# EAGLE design Microphone (EAGLE 7.6.0)
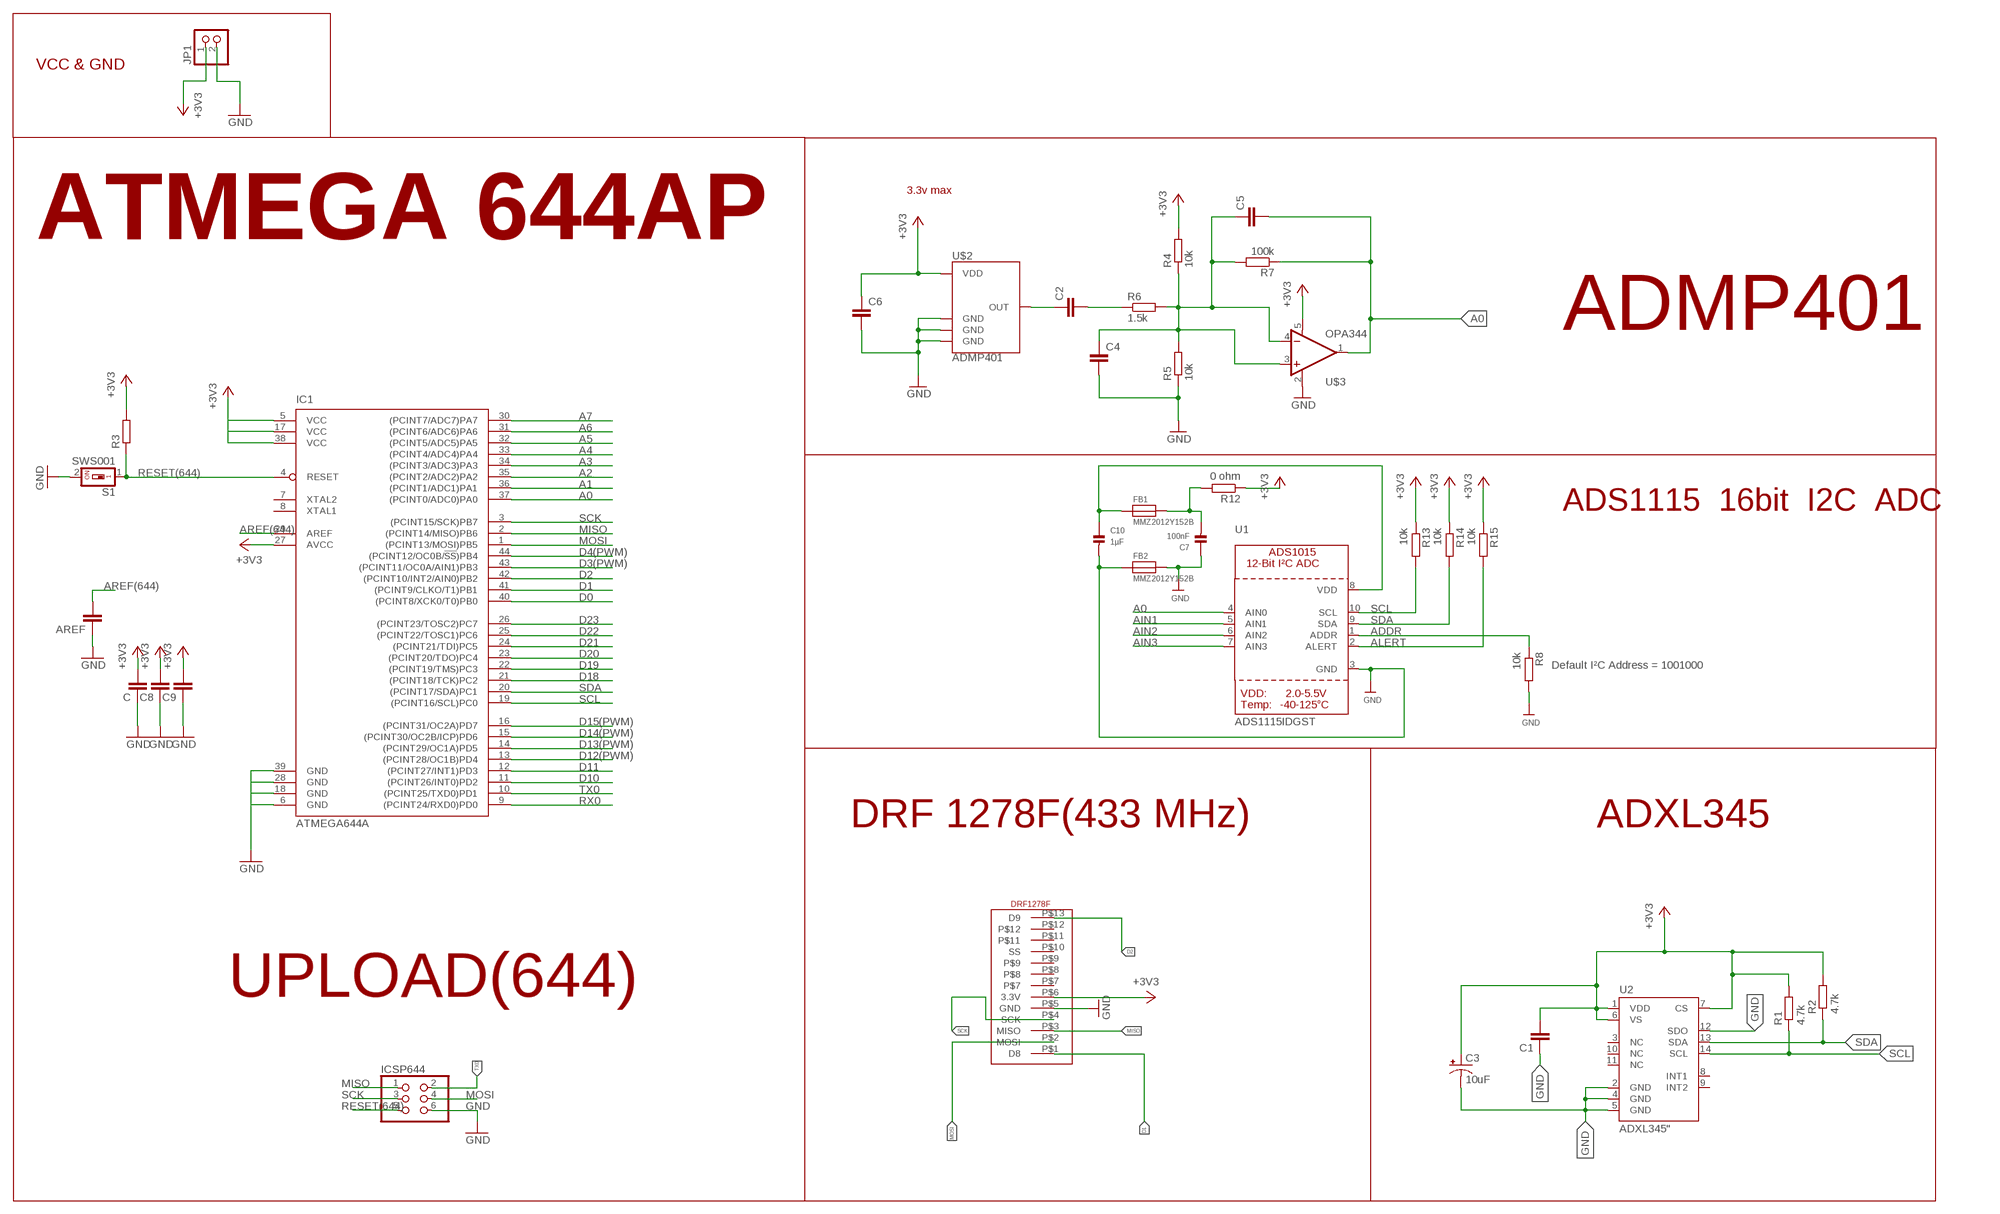
[diagram p0: schematic, sheet 1]

## Parts
AREF  100nF  C-EUC0805  [C0805]
C  22 uF  C-EUC0805  [C0805]
C1  0.1uF  C-EUC0805  [C0805]
C2  4.7uF  C-EUC0805  [C0805]
C3  10uF  CAP_POL1206  [EIA3216]
C4  1uF  C-EUC0805  [C0805]
C5  100pF  C-EUC0805  [C0805]
C6  0.1uF  C-EUC0805  [C0805]
C7  100nF  CAP_CERAMIC0805  [0805]
C8  100nF  C-EUC0805  [C0805]
C9  100nF  C-EUC0805  [C0805]
C10  1µF  CAP_CERAMIC0805  [0805]
FB1  MMZ2012Y152B  FERRITE0805  [0805]
FB2  MMZ2012Y152B  FERRITE0805  [0805]
IC1  ATMEGA644A  [TQFP44]
ICSP644  PINHD-2X3  [2X03]
JP1  PINHD-1X2  [1X02]
R1  4.7k  R-EU_R0805  [R0805]
R2  4.7k  R-EU_R0805  [R0805]
R3  R-EU_R0805  [R0805]
R4  10k  R-EU_R0805  [R0805]
R5  10k  R-EU_R0805  [R0805]
R6  1.5k  R-EU_R0805  [R0805]
R7  100k  R-EU_R0805  [R0805]
R8  10k  R-EU_R0805  [R0805]
R12  0 ohm  R-EU_R0805  [R0805]
R13  10k  R-EU_R0805  [R0805]
R14  10k  R-EU_R0805  [R0805]
R15  10k  R-EU_R0805  [R0805]
S1  SWS001  [SMS-001]
U1  ADS1115IDGST  ADC_ADS1015  [MSOP10]
U2  ADXL345"  [ADXL3451:1]
U$1  DRF1278F  [DIP13]
U$2  ADMP401  [ADMP401]
U$3  OPA344  [SOT23-5]

## Nets
+3V3: C1.2 C3.A(+) C6.1 C8.2 C9.2 C.2 IC1.5(VCC) IC1.17(VCC) IC1.27(AVCC) IC1.38(VCC) JP1.1 R1.2 R2.2 R3.2 R4.2 R12.1 R13.1 R14.1 R15.1 U2.1(VDD) U2.6(VS) U2.7(CS) U$1.P$6(3.3V) U$2.5(VDD) U$3.5(V+)
A0: C5.2 IC1.37((PCINT0/ADC0)PA0) R7.1 U1.4(AIN0) U$3.1(OUT)
A1: IC1.36((PCINT1/ADC1)PA1)
A2: IC1.35((PCINT2/ADC2)PA2)
A3: IC1.34((PCINT3/ADC3)PA3)
A4: IC1.33((PCINT4/ADC4)PA4)
A5: IC1.32((PCINT5/ADC5)PA5)
A6: IC1.31((PCINT6/ADC6)PA6)
A7: IC1.30((PCINT7/ADC7)PA7)
ADDR: R8.1 U1.1(ADDR)
AIN1: U1.5(AIN1)
AIN2: U1.6(AIN2)
AIN3: U1.7(AIN3)
ALERT: R15.2 U1.2(ALERT)
AREF(644): AREF.2 IC1.29(AREF)
D0: IC1.40((PCINT8/XCK0/T0)PB0)
D1: IC1.41((PCINT9/CLKO/T1)PB1) U$1.P$1(D8)
D2: IC1.42((PCINT10/INT2/AIN0)PB2) U$1.P$13(D9)
D3(PWM): IC1.43((PCINT11/OC0A/AIN1)PB3)
D4(PWM): IC1.44((PCINT12/OC0B/!SS!)PB4)
D10: IC1.11((PCINT26/INT0)PD2)
D11: IC1.12((PCINT27/INT1)PD3)
D12(PWM): IC1.13((PCINT28/OC1B)PD4)
D13(PWM): IC1.14((PCINT29/OC1A)PD5)
D14(PWM): IC1.15((PCINT30/OC2B/ICP)PD6)
D15(PWM): IC1.16((PCINT31/OC2A)PD7)
D18: IC1.21((PCINT18/TCK)PC2)
D19: IC1.22((PCINT19/TMS)PC3)
D20: IC1.23((PCINT20/TDO)PC4)
D21: IC1.24((PCINT21/TDI)PC5)
D22: IC1.25((PCINT22/TOSC1)PC6)
D23: IC1.26((PCINT23/TOSC2)PC7)
GND: AREF.1 C1.1 C3.C(-) C4.2 C6.2 C7.1 C8.1 C9.1 C10.2 C.1 FB2.1 FB2.2 IC1.6(GND) IC1.18(GND) IC1.28(GND) IC1.39(GND) ICSP644.6 JP1.2 R5.1 R8.2 S1.2 U1.3(GND) U2.2(GND) U2.4(GND) U2.5(GND) U2.12(SDO) U$1.P$5(GND) U$2.2(GND) U$2.4(GND) U$2.6(GND) U$3.2(V-)
MISO: IC1.2((PCINT14/MISO)PB6) ICSP644.1 U$1.P$3(MISO)
MOSI: IC1.1((PCINT13/MOSI)PB5) ICSP644.4 U$1.P$2(MOSI)
N$3: C2.1 U$2.1(OUT)
N$4: C2.2 R6.1
N$5: C4.1 C5.1 R4.1 R5.2 R6.2 R7.2 U$3.3(+IN) U$3.4(-IN)
N$7: C7.2 FB1.2 R12.2
N$8: C10.1 FB1.1 U1.8(VDD)
RESET(644): IC1.4(RESET) ICSP644.5 R3.1 S1.1
RX0: IC1.9((PCINT24/RXD0)PD0)
SCK: IC1.3((PCINT15/SCK)PB7) ICSP644.3 U$1.P$4(SCK)
SCL: IC1.19((PCINT16/SCL)PC0) R1.1 R13.2 U1.10(SCL) U2.14(SCL)
SDA: IC1.20((PCINT17/SDA)PC1) R2.1 R14.2 U1.9(SDA) U2.13(SDA)
TX0: IC1.10((PCINT25/TXD0)PD1) ICSP644.2
Unconnected: IC1.7(XTAL2) IC1.8(XTAL1) U2.3(NC) U2.8(INT1) U2.9(INT2) U2.10(NC) U2.11(NC) U$1.P$7 U$1.P$8 U$1.P$9 U$1.P$10(SS) U$1.P$11 U$1.P$12

## Notes on the sheet
- VCC & GND
- 3.3v max
- ATMEGA 644AP
- ADMP401
- ADS1115  16bit  I2C  ADC
- Default I²C Address = 1001000
- DRF 1278F(433 MHz) | ADXL345
- UPLOAD(644)

## Library data of the parts
AREF C C1 C2 C4-C6 C8 C9 = rcl:C-EU: CAPACITOR, European symbol
C3 = SparkFun:CAP_POL: Capacitor Polarized These are standard SMD and PTH capacitors. Normally 10uF, 47uF, and 100uF in electrolytic and tantalum varieties. Always verify the external diameter of the through hole cap, it varies with capacity, voltage, and manufacturer. The EIA devices should be standard.
C7 C10 = microbuilder:CAP_CERAMIC: Ceramic Capacitors 0402 - 0402 Surface Mount Capacitors 16pF 50V 5% [Digikey: 445-4899-2-ND] 18pF 50V 5% [Digikey: 490-1281-2-ND] 22pF 50V 5% [Digikey: 490-1283-2-ND] 68pF 50V 5% [Digikey: 490-1289-2-ND] 0.1uF 10V 10% [Digikey: 490-1318-2-ND] 1.0uF 6.3V 10% [Digikey: 490-1320-2-ND] 0603 - 0603 Surface Mount Capacitors 16 pF 50V 5% [Digikey: 445-5051-2-ND] 22 pF 50V [Digikey: PCC220ACVTR-ND] 33 pF 50V 5% [Digikey: 490-1415-1-ND] 56pF 50V 5% [Digikey: 490-1421-1-ND] 220pF 50V 5% [Digikey: 445-1285-1-ND] 680 pF 50V 2200 pF 50V 5% C0G [Digikey: 445-1297-1-ND] 5600 pF 100V 5% X7R [Digikey: 478-3711-1-ND] 0.1 µF 25V 10% [Digikey: PCC2277TR-ND] 0.22 µF 16V 10% X7R [Digikey: 445-1318-1-ND] 1.0 µF 25V 10% [Digikey: 445-5146-2-ND] 0603 - RF Specific 3pF 250V +/-0.1pF RF [Digikey: 712-1347-1-ND] 18 pF 250V 5% [Digikey: 478-3505-1-ND or 712-1322-1-ND] 56 pF 250V 5% C0G RF [Digikey: 490-4867-1-ND] 68 pF 250V RF [Digikey: 490-4868-1-ND] 0805 - 0805 Surface Mount Capacitors 220 pF 250V 2% RF Ceramic Capacitor [Digikey: 712-1398-1-ND] 1000 pF 50V 2% NP0 Ceramic Capacitor [Digikey: 478-3760-1-ND] 0.1 µF 25V 10% Ceramic Capacitor [Digikey: PCC1828TR-ND] 1.0 µF 16V 10% Ceramic Capacitor[Digikey: 490-1691-2-ND] 10.0 µF 10V 10% Ceramic Capacitor[Digikey: 709-1228-1-ND] 10.0 uF 16V 10% Ceramic Capacitor [Digikey: 478-5165-2-ND] 47 uF 6.3V 20% Ceramic Capacitor [Digikey: 587-1779-1-ND or 399-5506-1-ND] 1206 - 1206 Surface Mount Capacitors 47uF 10V 20% Ceramic Capacitor [Digikey: 490-5528-1-ND or 399-5508-1-ND or 445-6010-1-ND] 100uF 6.3V -20%, +80% Y5V Ceramic Capacitor (Digikey: 490-4512-1-ND, Mouser: 81-GRM31CF50J107ZE1L)
FB1 FB2 = microbuilder:FERRITE: Ferrite Bead 0603 MMZ1608B121C - 120 Ohm, 600mA Ferrite Chip - Digikey: 445-2164-1-ND BK1608HW121-T - 120 Ohm, 600mA Ferrite Chip - Digikey: 587-1876-2-ND 0805 HZ0805B272R-10 - 2.7K Ohm @ 100MHz, 200mA 0.8 Ohm DC Resistance - Digikey: 240-2504-1-ND (see also Murata BLM21BD272SN1L)
IC1 = atmel:ATMEGA644: 8-bit Microcontroller with 64K Bytes In-System Programmable Flash Source: http://www.atmel.com/dyn/resources/prod_documents/doc2593.pdf; MPN: ATMEGA644PV-10AU; OC_FARNELL: 1455123; OC_NEWARK: 58M3748
ICSP644 = pinhead:PINHD-2X3: PIN HEADER
JP1 = pinhead:PINHD-1X2: PIN HEADER
R1-R3 R8 R12-R15 = resistor:R-EU_: RESISTOR, European symbol
R4-R7 = rcl:R-EU_: RESISTOR, European symbol
S1 = smd-special:SWS001: SMD Dip Switch 1 pol.
U1 = microbuilder:ADC_ADS1015: ADS1015 - 12-bit 4-Channel I2C ADC with Internal PGA VDD: 2.0-5.5V Sampling Rate: 3.3ksps Gain Settings: 2/3, 1, 2, 4, 8, 16 I2C Address: ADDR low = 1001000x, ADDR high = 1001001x Internal Comparator The ADS1015 includes an internal comparator that can be set to output a high-level on ALERT when the conversion results exceeeds a pre-defined upper level, and will deassert itself when the level falls below a pre-defined lower threshold level. It can also be set to windowed mode where the ALERT pin will be asserted if the data exceeds the upper threshold or falls below the lower threshold.
U2 = SparkFun-Sensors:ADXL345: 3-axis SPI/I2C 2/4/8/16g accelerometer; PROD_ID: IC-09097
U$1 = small_header:DRF1278F
U$2 = SparkFun-Sensors:ADMP401: Omnidirection bottom-port MEMS microphone
U$3 = SparkFun-AnalogIC:OPA344: Single gate rail-to-rail output op-amp. Inputs extend 300mV past rails.; PROD_ID: IC-08251

## Board
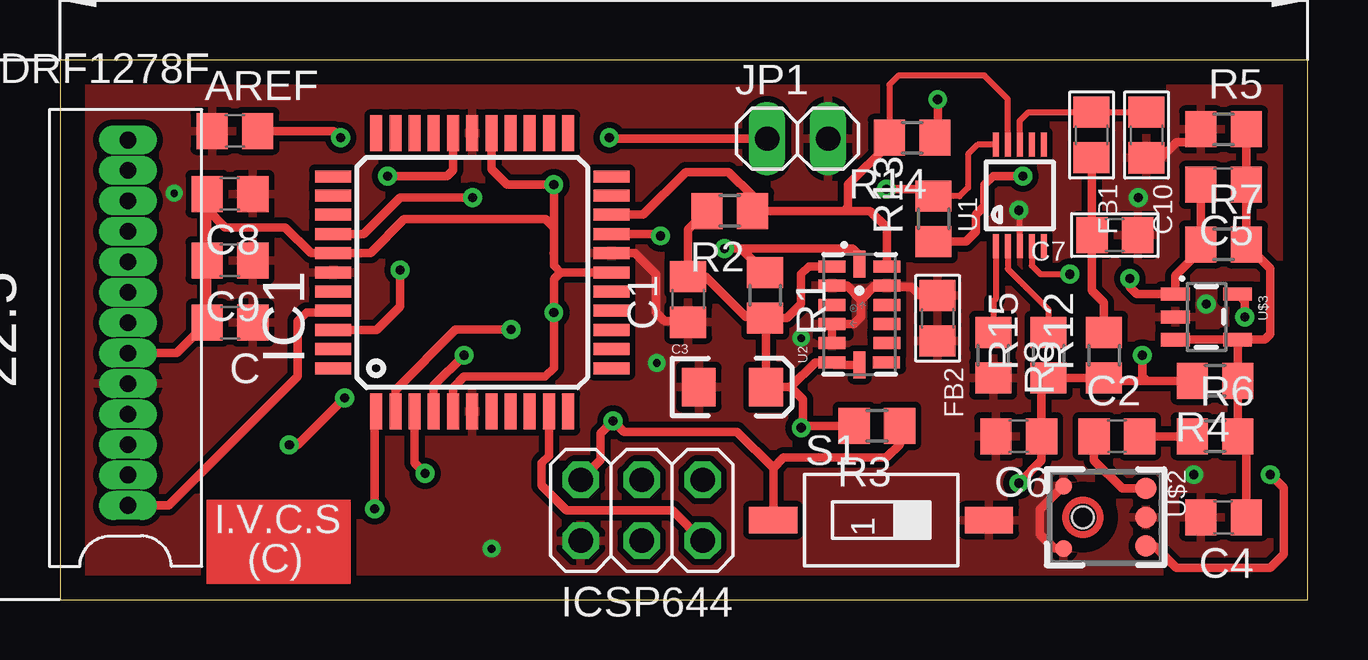
[diagram p1: board, top side]
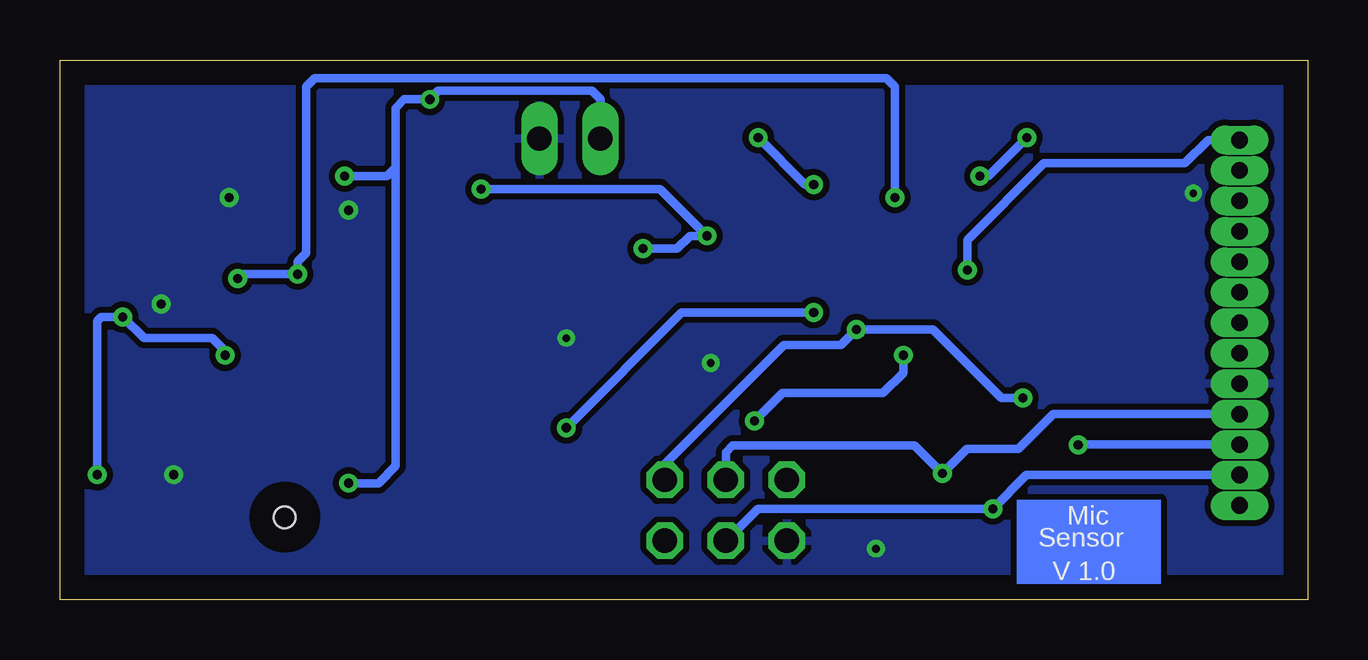
[diagram p2: board, bottom side, seen from below]

Size 52 x 22.5 mm. Coordinates in mm from the lower left corner, seen from the top.
Outline: 0,0 52,0 52,22.5 0,22.5 0,0
Copper layers (1*16): Top 0.035mm / dielectric 1.5mm / Bottom 0.035mm
Design rules "default *": minimum track width 9mil, minimum drill 11mil, track to track 6mil, track to pad 6mil, pad to pad 6mil, via to via 6mil, smd to smd 6mil, copper to edge 40mil, drill to drill 8mil, minimum pad ring 10mil, minimum via ring 8mil, stop-mask expansion 4mil, vias tented up to drill 0mil, thermal gap 10mil

### Footprints (pad centres in the part's own frame; a part is rotated, then mirrored left to right if it is on the bottom)
C0805 = smd 1.3 x 1.5: 1 -0.95,0; 2 0.95,0
EIA3216 = smd 1.4 x 1.6: A 1.4,0; C -1.4,0
0805 = smd 1.3 x 1.5: 1 -0.95,0; 2 0.95,0
TQFP44 = smd 1.5 x 0.5: 1 -5.8,4; 2 -5.8,3.2; 3 -5.8,2.4; 4 -5.8,1.6; 5 -5.8,0.8; 6 -5.8,0; 7 -5.8,-0.8; 8 -5.8,-1.6; 9 -5.8,-2.4; 10 -5.8,-3.2; 11 -5.8,-4; 23 5.8,-4; 24 5.8,-3.2; 25 5.8,-2.4; 26 5.8,-1.6; 27 5.8,-0.8; 28 5.8,0; 29 5.8,0.8; 30 5.8,1.6; 31 5.8,2.4; 32 5.8,3.2; 33 5.8,4 | smd 0.5 x 1.5: 12 -4,-5.8; 13 -3.2,-5.8; 14 -2.4,-5.8; 15 -1.6,-5.8; 16 -0.8,-5.8; 17 0,-5.8; 18 0.8,-5.8; 19 1.6,-5.8; 20 2.4,-5.8; 21 3.2,-5.8; 22 4,-5.8; 34 4,5.8; 35 3.2,5.8; 36 2.4,5.8; 37 1.6,5.8; 38 0.8,5.8; 39 0,5.8; 40 -0.8,5.8; 41 -1.6,5.8; 42 -2.4,5.8; 43 -3.2,5.8; 44 -4,5.8
2X03 = drill 1.016 octagon: 1 -2.54,-1.27; 2 -2.54,1.27; 3 0,-1.27; 4 0,1.27; 5 2.54,-1.27; 6 2.54,1.27
1X02 = drill 1.016 long: 1 -1.27,0; 2 1.27,0
R0805 = smd 1.3 x 1.5: 1 -0.95,0; 2 0.95,0
SMS-001 = smd 1.092 x 2.007: 1 0,-4.496; 2 0,4.496
MSOP10 = smd 0.25 x 1: 1 -1,-2.113; 2 -0.5,-2.113; 3 0,-2.113; 4 0.5,-2.113; 5 1,-2.113; 6 1,2.113; 7 0.5,2.113; 8 0,2.113; 9 -0.5,2.113; 10 -1,2.113
ADXL3451:1 = smd 0.5 x 1.124: 1 2,1.138; 2 1.2,1.138; 3 0.4,1.138; 4 -0.4,1.138; 5 -1.2,1.138; 6 -2,1.138; 8 -2,-1.13; 9 -1.2,-1.138; 10 -0.4,-1.138; 11 0.4,-1.138; 12 1.2,-1.138; 13 2,-1.138 | smd 1.124 x 0.5: 7 -2.1,0; 14 2.1,0
DIP13 = drill 0.7 long: P$1 -2,0; P$2 -2,-1.27; P$3 -2,-2.54; P$4 -2,-3.81; P$5 -2,-5.08; P$6 -2,-6.35; P$7 -2,-7.62; P$8 -2,-8.89; P$9 -2,-10.16; P$10 -2,-11.43; P$11 -2,-12.7; P$12 -2,-13.97; P$13 -2,-15.24
ADMP401 = smd 0.9 x 0.9: 1 -1.2,2.62; 5 1.2,2.62; 6 0,2.62 | smd 0.7 x 0.7: 2 1.3,-0.8; 4 -1.3,-0.8 | hole 0.9: 0,0
SOT23-5 = smd 0.55 x 1.2: 1 -0.95,-1.3; 2 0,-1.3; 3 0.95,-1.3; 4 0.95,1.3; 5 -0.95,1.3

### Placement (x,y rotation side)
AREF  7.29,19.54 0 top
C  7.09,11.54 180 top
C1  26.19,12.52 90 top
C2  44.05,6.81 0 top
C3  28.03,8.86 0 top
C4  48.5,3.43 180 top
C5  48.5,17.3 180 top
C6  39.96,6.81 180 top
C7  43.97,15.2 180 top
C8  7.09,16.92 180 top
C9  7.09,14.14 180 top
C10  45.29,19.37 270 top
FB1  43,19.37 270 top
FB2  36.58,11.73 270 top
IC1  17.18,13.64 90 top
ICSP644  24.25,3.72 180 top
JP1  30.74,19.22 0 top
R1  29.39,12.68 270 top
R2  27.91,16.2 180 top
R3  34.05,7.25 180 top
R4  48.14,9.12 180 top
R5  48.5,19.61 0 top
R6  48.14,6.81 0 top
R7  48.5,14.81 0 top
R8  38.9,10.19 270 top
R12  43.52,10.19 90 top
R13  36.41,15.88 90 top
R14  35.52,19.25 180 top
R15  41.21,10.19 90 top
S1  34.23,3.31 270 top
U1  40.01,16.85 0 top
U2  33.32,11.89 90 top
U$1  0.83,3.92 180 top
U$2  42.63,3.43 270 top
U$3  47.79,11.79 270 top

### Tracks (layer width: path | path; a pad name or v marks a point on that pad's centre or on a via)
+3V3  (via drill 0.38)
  Top 0.305: R1.2 29.6,11.73
  Top 0.356: IC1.27 17.98,17.95 18.63,17.3 v20.58,17.3 20.58,15.52 | 20.58,15.52 20.58,14.45 | 20.58,14.45 20.58,13.92 20.86,13.64 | 20.86,13.64 IC1.17 | 20.57,14.44 20.58,14.45 | U$1.P$6 4.87,10.27 C.2 C9.2 C8.2 6.14,16.27 6.89,15.52 9.38,15.52 10.46,14.44 IC1.38 11.39,14.45 12.94,14.45 14.35,15.87 20.24,15.87 20.58,15.52 | v30.9,7.16 30.98,7.25 | 30.98,7.25 R3.2 | IC1.5 16.38,8.83 16.85,9.3 20.23,9.3 20.58,9.65 v20.58,11.96 20.58,13.37 20.86,13.64 | JP1.1 22.93,19.22 v22.89,19.25 | 45.3,9.12 43.64,9.12 R12.1 R15.1 40.91,8.94 C6.1 40.91,5.8 v39.96,4.85 | 45.3,9.12 R4.2 | U$3.5 49.39,12.44 v49.39,11.79 | v36.59,20.86 36.59,19.37 R14.1 | R13.1 37.77,14.93 38.19,15.34 38.19,16.05 38.54,16.41 38.54,17.3 38.9,17.65 v40.14,17.65 | v45.12,10.19 45.12,9.3 45.3,9.12 | R2.2 26.19,15.42 C1.2 26.91,13.47 28.58,11.79 29.34,11.79 R1.2 29.43,11.7 C3.A 30.46,8.86 | 29.6,11.73 30.31,11.73 30.9,12.32 30.9,13.56 31.22,13.89 U2.1 | 30.46,8.86 31.49,9.89 U2.6 32.29,9.79 U2.7 | 30.98,7.25 30.98,8.34 30.46,8.86 | U$2.5 45.62,2.23 46.53,1.32 50.44,1.32 51,1.88 51,4.66 v50.45,5.21
  Bottom 0.356: v20.58,17.3 20.94,17.3 v22.89,19.25 | v50.45,5.21 50.45,11.61 50.28,11.79 v49.39,11.79 48.5,10.9 45.65,10.9 45.12,10.37 v45.12,10.19 | JP1.1 29.47,20.86 29.83,21.21 36.23,21.21 v36.59,20.86 37.65,20.86 38.01,20.5 38.01,18.01 | 38.01,18.01 38.01,5.56 38.72,4.85 v39.96,4.85 | v40.14,17.65 38.36,17.65 38.01,18.01 | v20.58,11.96 26.09,11.96 v30.9,7.16
A0  (via drill 0.38)
  Top 0.254: U1.4 40.51,13.93 40.87,13.56 v42.1,13.56
  Top 0.356: IC1.37 12.66,15.24 14.18,16.77 v17.2,16.77 | v44.59,13.39 44.59,13.03 44.88,12.74 U$3.1 46.49,13.51 47.55,14.57 R7.1 C5.2
  Bottom 0.356: v17.2,16.77 17.2,21.39 17.56,21.74 41.39,21.74 41.74,21.39 41.74,14.45 42.1,14.1 v42.1,13.56 44.41,13.56 v44.59,13.39
ADDR
  Top 0.254: U1.1 39.01,12.54 38.91,12.45 38.91,11.15 R8.1
ALERT
  Top 0.254: U1.2 39.51,13.78 41.2,12.09 41.2,11.15 R15.2
AREF(644)  (via drill 0.38)
  Top 0.356: AREF.2 11.41,19.54 v11.69,19.25 | v13.65,17.65 16.14,17.65 16.38,17.9 IC1.29
  Bottom 0.356: v11.69,19.25 13.29,17.65 v13.65,17.65
D1
  Top 0.356: U$1.P$1 4.54,3.92 9.91,9.3 9.91,11.61 10.27,11.96 11.3,11.96 IC1.41
D2  (via drill 0.38)
  Top 0.356: 11.39,11.25 IC1.42 13.21,11.24 14.18,12.21 v14.18,13.74
  Bottom 0.356: U$1.P$13 4.14,19.16 5.12,18.19 10.98,18.19 14.18,14.99 v14.18,13.74
GND  (via drill 0.3, 0.33, 0.38)
  Top 0.254: U1.3 40.01,16.19 v39.96,16.23
  Top 0.356: IC1.18 23.97,14.44 24.85,13.56 24.85,11.96 25.21,11.61 26.14,11.61 C1.1 | FB2.1 35.87,12.68 35.52,13.03 34.52,13.03 U2.12 33.98,13.09 33.38,12.5 | C10.2 45.88,18.42 46.54,19.08 47.02,19.08 R5.1 | U$2.2 41.44,2.13 40.85,2.72 40.85,3.75 U$2.4 | U2.2 32.8,13.09 33.38,12.5 | 33.38,12.5 33.38,11.79 33.09,11.49 U2.4 U2.5
  other vias: 30.9,10.9 4.76,16.94 47.25,5.21 47.79,12.32 44.94,16.77 17.99,2.12 24.88,9.87
  pour Top (isolate 0.254): 0.28,22.43 0.15,0.28 51.81,0.28 51.93,22.43
  pour Bottom (isolate 0.254): 0.17,22.43 51.93,22.43 51.91,0.2 0.14,0.2
MISO  (via drill 0.38)
  Top 0.356: v9.56,6.45 9.91,6.45 v11.87,8.41 | IC1.2 13.98,8.74 16.49,11.25 v18.8,11.25
  Bottom 0.356: U$1.P$3 9.55,6.46 v9.56,6.45 | v11.87,8.41 12.76,8.41 15.61,11.25 v18.8,11.25 19.44,10.62 21.83,10.62 26.79,5.66 ICSP644.1
MOSI  (via drill 0.38)
  Top 0.356: v13.12,3.79 13.12,7.78 IC1.1
  Bottom 0.356: ICSP644.4 22.91,3.79 v13.12,3.79 11.71,5.19 U$1.P$2
N$3
  Top 0.356: U$2.1 44.27,4.63 43.1,5.8 C2.1
N$4
  Top 0.356: C2.2 R6.1
N$5
  Top 0.356: R5.2 C5.1 R7.2 50.45,13.8 50.45,11.08 50.22,10.84 U$3.4 | U$3.3 U$3.4 | C4.1 49.45,6.45 R6.2 R4.1 U$3.4
N$7
  Top 0.356: FB1.2 43.02,17.51 C7.2 43.02,12.88 43.52,12.38 R12.2
N$8
  Top 0.254: U1.8 40.01,19.96 40.36,20.32 FB1.1 | FB1.1 C10.1
  Top 0.356: FB1.1
RESET(644)  (via drill 0.38)
  Top 0.356: S1.1 29.73,5.49 | 29.73,5.49 28.23,6.99 23.5,6.99 v23.05,7.44 22.54,6.94 22.54,5.82 ICSP644.5 | 15.61,7.87 IC1.4 15.58,8.92 v16.85,10.19 | R3.1 35,6.47 34.45,5.92 30.16,5.92 29.73,5.49
  Bottom 0.356: v16.85,10.19 16.85,9.45 17.69,8.61 21.88,8.61 v23.05,7.44
SCK  (via drill 0.38)
  Top 0.356: IC1.3 14.78,5.7 v15.22,5.26
  Bottom 0.356: U$1.P$4 10.59,7.73 12.05,6.28 14.21,6.28 v15.22,5.26 16.39,6.43 23.96,6.43 24.25,6.14 ICSP644.3
SCL  (via drill 0.38)
  Top 0.254: U1.10 38.24,18.96 37.85,18.57 37.85,17.17 37.49,16.82 36.42,16.82 R13.2
  Top 0.356: R1.1 28.39,14.63 | 28.39,14.63 v27.7,14.63 | IC1.19 24.95,15.24 v25.03,15.16 | 28.39,14.63 33.03,14.63 33.32,14.34 U2.14 | R13.2 36.11,17.12 v34.45,17.12
  Bottom 0.356: v27.7,14.63 26.27,14.63 25.74,15.16 v25.03,15.16 26.98,17.12 v34.45,17.12
SDA
  Top 0.254: U1.9 39.51,20.87 38.53,21.84 34.95,21.84 34.57,21.46 R14.2 | R14.2
  Top 0.356: 32.67,16.2 R2.1 28.86,16.84 27.87,17.83 26.09,17.83 24.31,16.04 IC1.20 | 32.67,16.2 33.77,16.2 34.46,15.51 U2.13 34.81,13.9 | 32.67,16.2 32.85,16.38 32.85,17.3 34.57,19.02 R14.2
TX0
  Top 0.356: ICSP644.2 25.53,3.71 21.12,3.71 20.07,4.75 20.07,5.69 20.38,6 IC1.10
(copper drawn outside any net)
  shapes: Bottom area x1, Top area x1

### Text on the board
tPlace: I.V.C.S | (C)
bPlace: Mic | Sensor | V 1.0